# EAGLE design CUTTER (EAGLE 8.6.3)
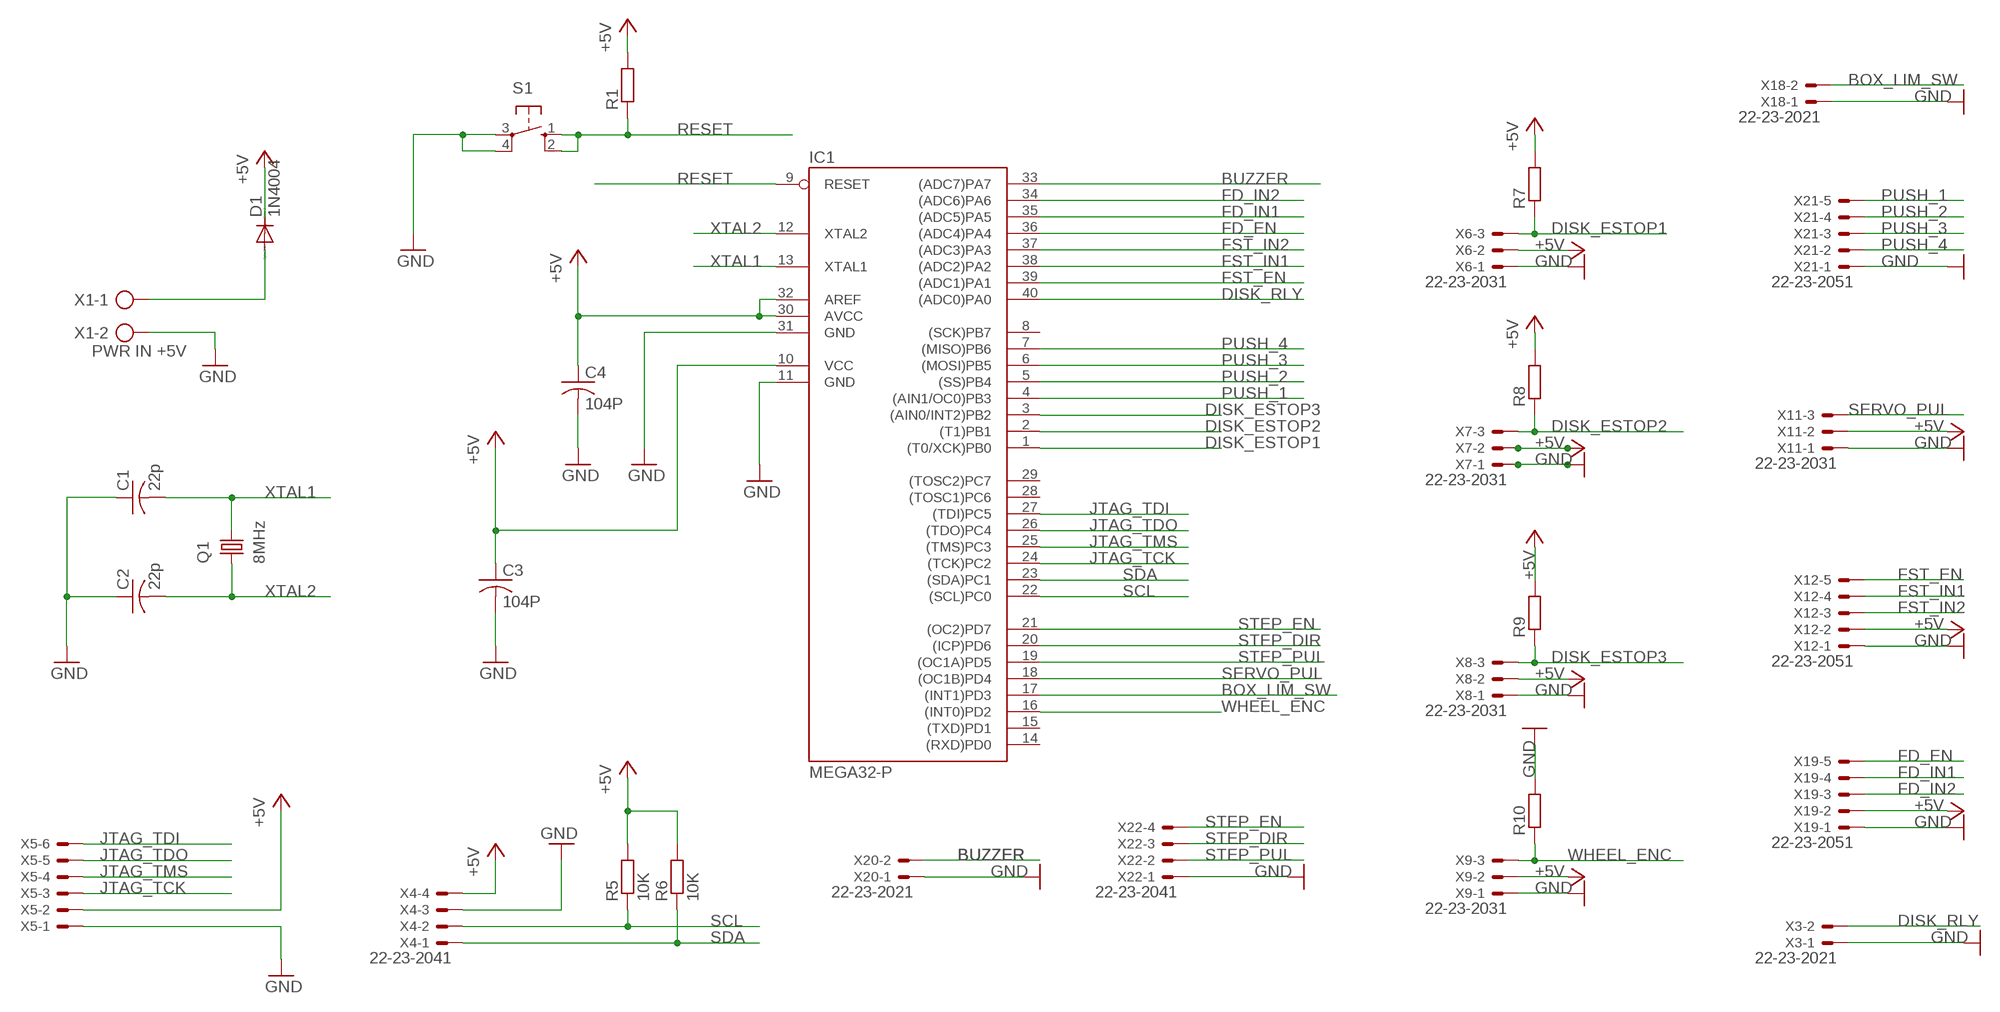
[diagram p0: schematic, sheet 1]

## Parts
C1  22p  C-US025-025X050  [C025-025X050]
C2  22p  C-US025-025X050  [C025-025X050]
C3  104P  C-US025-025X050  [C025-025X050]
C4  104P  C-US025-025X050  [C025-025X050]
D1  1N4004  [DO41-10]
IC1  MEGA32-P  [DIL40]
Q1  8MHz  CRYSTALHC49S  [HC49/S]
R1  R-EU_0207/10  [0207/10]
R5  10K  R-EU_0207/10  [0207/10]
R6  10K  R-EU_0207/10  [0207/10]
R7  R-EU_0207/10  [0207/10]
R8  R-EU_0207/10  [0207/10]
R9  R-EU_0207/10  [0207/10]
R10  R-EU_0207/10  [0207/10]
S1  10-XX  [B3F-10XX]
X1  PWR IN +5V  AK500/2  [AK500/2]
X3  22-23-2021  [22-23-2021]
X4  22-23-2041  [22-23-2041]
X5  22-23-2061  [22-23-2061]
X6  22-23-2031  [22-23-2031]
X7  22-23-2031  [22-23-2031]
X8  22-23-2031  [22-23-2031]
X9  22-23-2031  [22-23-2031]
X11  22-23-2031  [22-23-2031]
X12  22-23-2051  [22-23-2051]
X18  22-23-2021  [22-23-2021]
X19  22-23-2051  [22-23-2051]
X20  22-23-2021  [22-23-2021]
X21  22-23-2051  [22-23-2051]
X22  22-23-2041  [22-23-2041]

## Nets
+5V: C3.1 C4.1 D1.C IC1.10(VCC) IC1.30(AVCC) IC1.32(AREF) R1.2 R5.2 R6.2 R7.2 R8.2 R9.2 X4.4 X5.2 X6.2 X7.2 X8.2 X9.2 X11.2 X12.2 X19.2
BOX_LIM_SW: IC1.17((INT1)PD3) X18.2
BUZZER: IC1.33((ADC7)PA7) X20.2
DISK_ESTOP1: IC1.1((T0/XCK)PB0) R7.1 X6.3
DISK_ESTOP2: IC1.2((T1)PB1) R8.1 X7.3
DISK_ESTOP3: IC1.3((AIN0/INT2)PB2) R9.1 X8.3
DISK_RLY: IC1.40((ADC0)PA0) X3.2
FD_EN: IC1.36((ADC4)PA4) X19.5
FD_IN1: IC1.35((ADC5)PA5) X19.4
FD_IN2: IC1.34((ADC6)PA6) X19.3
FST_EN: IC1.39((ADC1)PA1) X12.5
FST_IN1: IC1.38((ADC2)PA2) X12.4
FST_IN2: IC1.37((ADC3)PA3) X12.3
GND: C1.1 C2.1 C3.2 C4.2 IC1.11(GND) IC1.31(GND) R10.2 S1.3(P) S1.4(P1) X1.2 X3.1 X4.3 X5.1 X6.1 X7.1 X8.1 X9.1 X11.1 X12.1 X18.1 X19.1 X20.1 X21.1 X22.1
JTAG_TCK: IC1.24((TCK)PC2) X5.3
JTAG_TDI: IC1.27((TDI)PC5) X5.6
JTAG_TDO: IC1.26((TDO)PC4) X5.5
JTAG_TMS: IC1.25((TMS)PC3) X5.4
N$1: D1.A X1.1
PUSH_1: IC1.4((AIN1/OC0)PB3) X21.5
PUSH_2: IC1.5((SS)PB4) X21.4
PUSH_3: IC1.6((MOSI)PB5) X21.3
PUSH_4: IC1.7((MISO)PB6) X21.2
RESET: IC1.9(RESET) R1.1 S1.1(S) S1.2(S1)
SCL: IC1.22((SCL)PC0) R5.1 X4.2
SDA: IC1.23((SDA)PC1) R6.1 X4.1
SERVO_PUL: IC1.18((OC1B)PD4) X11.3
STEP_DIR: IC1.20((ICP)PD6) X22.3
STEP_EN: IC1.21((OC2)PD7) X22.4
STEP_PUL: IC1.19((OC1A)PD5) X22.2
WHEEL_ENC: IC1.16((INT0)PD2) R10.1 X9.3
XTAL1: C1.2 IC1.13(XTAL1) Q1.2
XTAL2: C2.2 IC1.12(XTAL2) Q1.1
Unconnected: IC1.8((SCK)PB7) IC1.14((RXD)PD0) IC1.15((TXD)PD1) IC1.28((TOSC1)PC6) IC1.29((TOSC2)PC7)

## Library data of the parts
C1-C4 = rcl:C-US: CAPACITOR, American symbol; SPICEPREFIX: C
D1 = diode:1N4004: DIODE general purpose rectifier, 1 A
IC1 = atmel:MEGA32-P: MICROCONTROLLER 32 Kbytes FLASH 2 Kbytes SRAM 1 Kbytes EEPROM USART 8-channel 10 bit ADC Source: www.atmel.com .. doc2503.pdf; MPN: ATMEGA32-16PU; OC_FARNELL: 1661729; OC_NEWARK: 51P1794
Q1 = crystal:CRYSTAL: CRYSTAL; OC_FARNELL: 1667008; OC_NEWARK: unknown
R1 R5-R10 = rcl:R-EU_: RESISTOR, European symbol; SPICEPREFIX: R
S1 = switch-omron:10-XX: OMRON SWITCH; MPN: B3F-1000; OC_FARNELL: 176432; OC_NEWARK: 36M3542
X1 = con-ptr500:AK500/2: CONNECTOR; OC_FARNELL: unknown; OC_NEWARK: unknown; SPICEPREFIX: X
X3 X18 X20 = con-molex:22-23-2021: .100" (2.54mm) Center Header - 2 Pin; MF: MOLEX; MPN: 22-23-2021; OC_FARNELL: 1462926; OC_NEWARK: 25C3832
X4 X22 = con-molex:22-23-2041: .100" (2.54mm) Center Header - 4 Pin; MF: MOLEX; MPN: 22-23-2041; OC_FARNELL: 1462920; OC_NEWARK: 38C0355
X5 = con-molex:22-23-2061: .100" (2.54mm) Center Header - 6 Pin; MF: MOLEX; MPN: 22-23-2061; OC_FARNELL: 1462922; OC_NEWARK: 27C1933
X6-X9 X11 = con-molex:22-23-2031: .100" (2.54mm) Center Header - 3 Pin; MF: MOLEX; MPN: 22-23-2031; OC_FARNELL: 1462950; OC_NEWARK: 30C0862
X12 X19 X21 = con-molex:22-23-2051: .100" (2.54mm) Center Header - 5 Pin; MF: MOLEX; MPN: 22-23-2051; OC_FARNELL: 1462952; OC_NEWARK: 38C9178

## Board
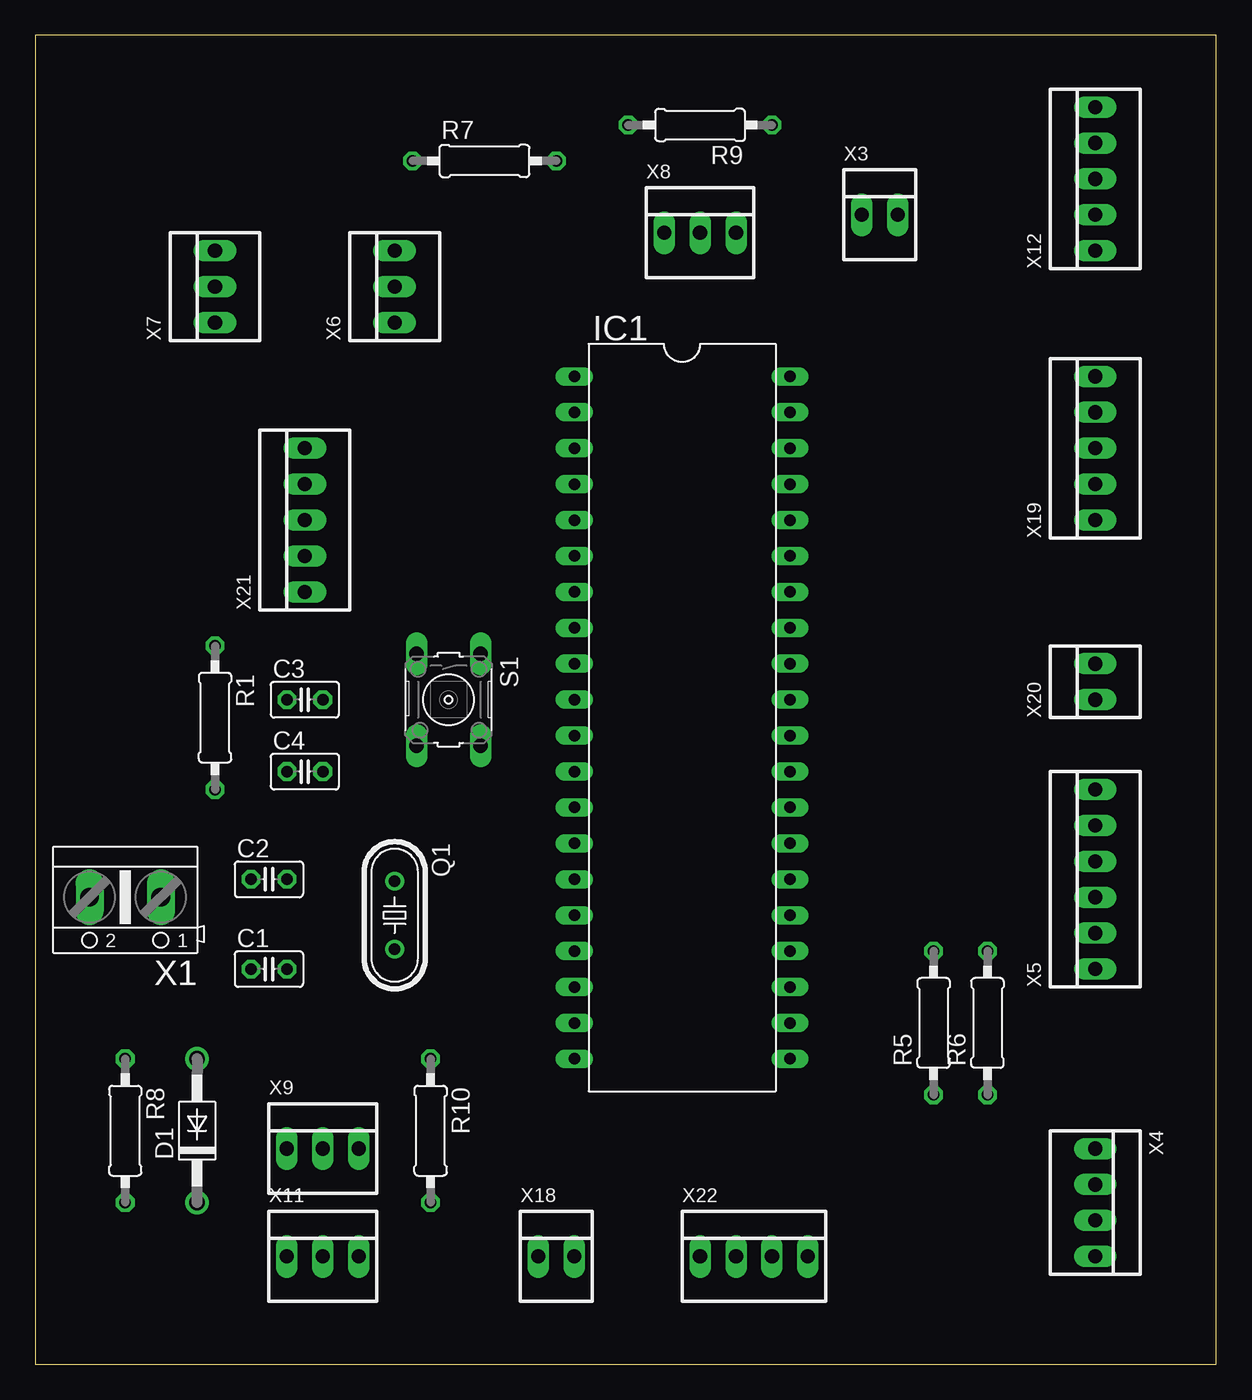
[diagram p1: board, top side]
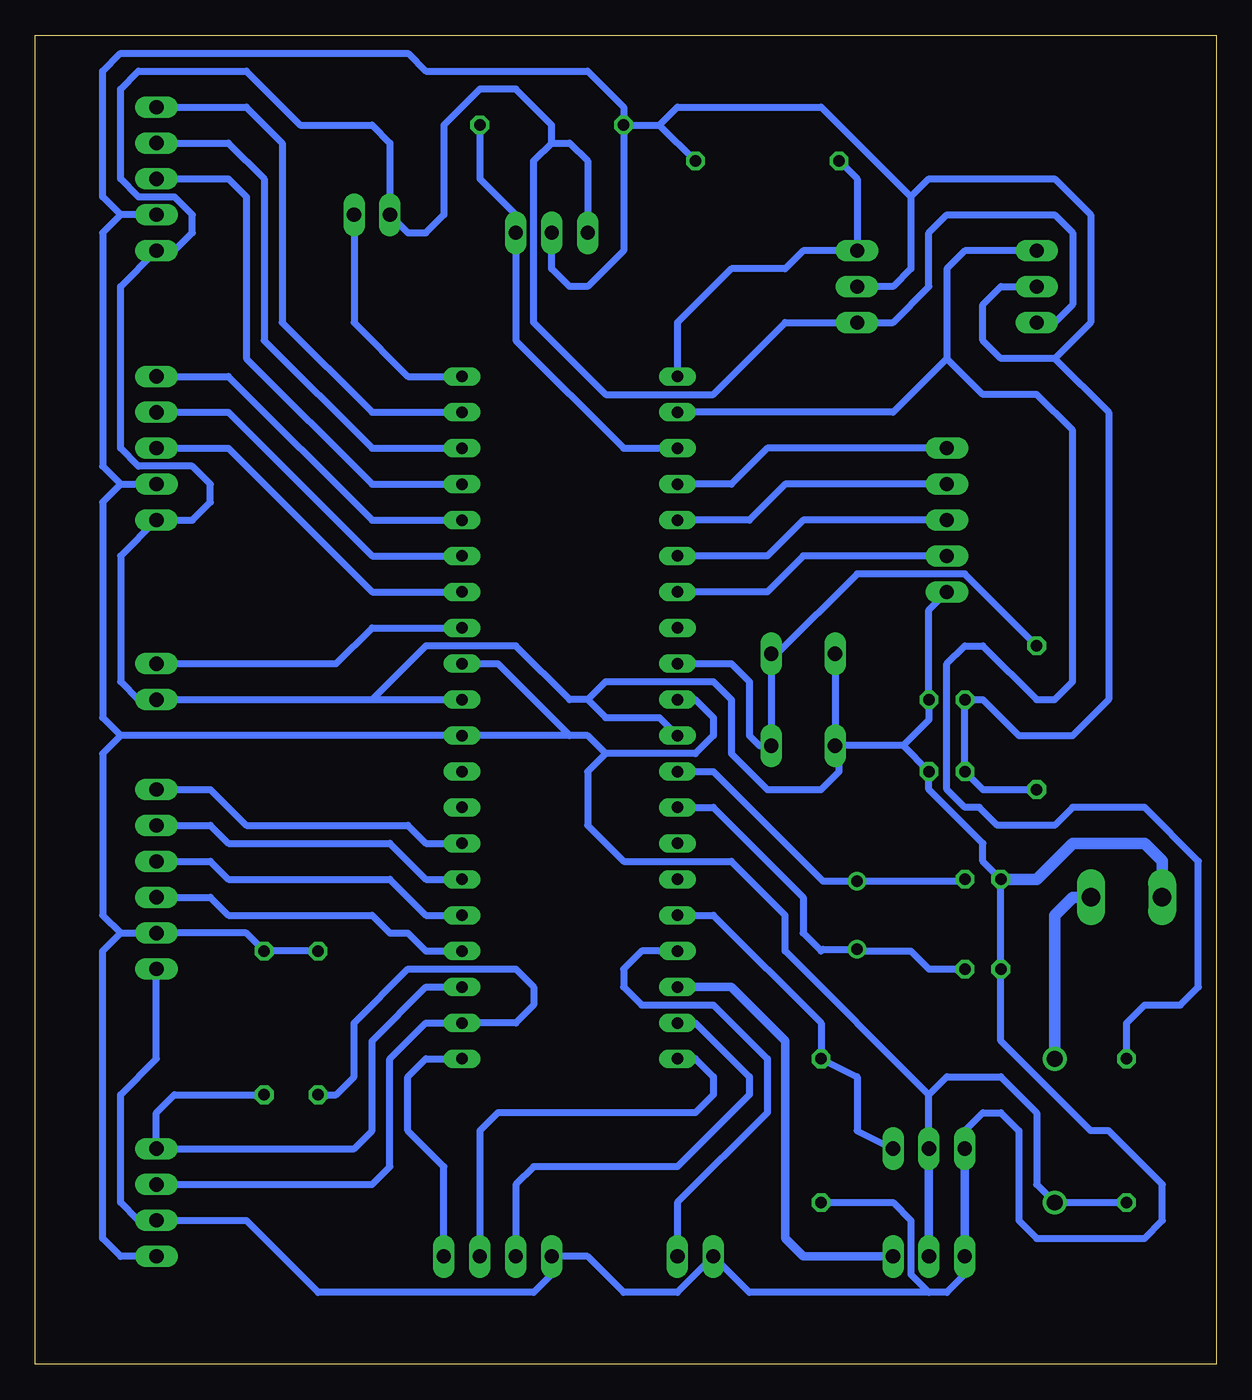
[diagram p2: board, bottom side, seen from below]

Size 83.49 x 93.97 mm. Coordinates in mm from the lower left corner, seen from the top.
Outline: 0,0 83.49,0 83.49,93.97 0,93.97 0,0
Copper layers (1*16): Top 0.035mm / dielectric 1.5mm / Bottom 0.035mm
Design rules "default": minimum track width 6mil, minimum drill 0.35mm, track to track 6mil, track to pad 6mil, pad to pad 6mil, via to via 6mil, smd to smd 6mil, copper to edge 40mil, drill to drill 6mil, minimum pad ring 10mil, minimum via ring 8mil, stop-mask expansion 4mil, vias tented up to drill 0mil, thermal gap 10mil

### Footprints (pad centres in the part's own frame; a part is rotated, then mirrored left to right if it is on the bottom)
C025-025X050 = drill 0.813 octagon: 1 -1.27,0; 2 1.27,0
DO41-10 = drill 1.118: A 5.08,0; C -5.08,0
DIL40 = drill 0.813 long: 1 -24.13,-7.62; 2 -21.59,-7.62; 3 -19.05,-7.62; 4 -16.51,-7.62; 5 -13.97,-7.62; 6 -11.43,-7.62; 7 -8.89,-7.62; 8 -6.35,-7.62; 9 -3.81,-7.62; 10 -1.27,-7.62; 11 1.27,-7.62; 12 3.81,-7.62; 13 6.35,-7.62; 14 8.89,-7.62; 15 11.43,-7.62; 16 13.97,-7.62; 17 16.51,-7.62; 18 19.05,-7.62; 19 21.59,-7.62; 20 24.13,-7.62; 21 24.13,7.62; 22 21.59,7.62; 23 19.05,7.62; 24 16.51,7.62; 25 13.97,7.62; 26 11.43,7.62; 27 8.89,7.62; 28 6.35,7.62; 29 3.81,7.62; 30 1.27,7.62; 31 -1.27,7.62; 32 -3.81,7.62; 33 -6.35,7.62; 34 -8.89,7.62; 35 -11.43,7.62; 36 -13.97,7.62; 37 -16.51,7.62; 38 -19.05,7.62; 39 -21.59,7.62; 40 -24.13,7.62
HC49/S = drill 0.813: 1 -2.413,0; 2 2.413,0
0207/10 = drill 0.813 octagon: 1 -5.08,0; 2 5.08,0
B3F-10XX = drill 1.016 long: 1 -3.251,2.261; 2 3.251,2.261; 3 -3.251,-2.261; 4 3.251,-2.261
AK500/2 = drill 1.321 long: 1 -2.515,0; 2 2.515,0
22-23-2021 = drill 1 long: 1 -1.27,0; 2 1.27,0
22-23-2041 = drill 1 long: 1 -3.81,0; 2 -1.27,0; 3 1.27,0; 4 3.81,0
22-23-2061 = drill 1 long: 1 -6.35,0; 2 -3.81,0; 3 -1.27,0; 4 1.27,0; 5 3.81,0; 6 6.35,0
22-23-2031 = drill 1 long: 1 -2.54,0; 2 0,0; 3 2.54,0
22-23-2051 = drill 1 long: 1 -5.08,0; 2 -2.54,0; 3 0,0; 4 2.54,0; 5 5.08,0

### Placement (x,y rotation side)
C1  16.51,27.94 0 top
C2  16.51,34.29 0 top
C3  19.05,46.99 0 top
C4  19.05,41.91 0 top
D1  11.43,16.51 90 top
IC1  45.72,45.72 270 top
Q1  25.4,31.75 270 top
R1  12.7,45.72 270 top
R5  63.5,24.13 90 top
R6  67.31,24.13 90 top
R7  31.75,85.09 0 top
R8  6.35,16.51 270 top
R9  46.99,87.63 180 top
R10  27.94,16.51 270 top
S1  29.21,46.99 270 top
X1  6.35,33.02 180 top
X3  59.69,81.28 0 top
X4  74.93,11.43 270 top
X5  74.93,34.29 90 top
X6  25.4,76.2 90 top
X7  12.7,76.2 90 top
X8  46.99,80.01 0 top
X9  20.32,15.24 0 top
X11  20.32,7.62 0 top
X12  74.93,83.82 90 top
X18  36.83,7.62 0 top
X19  74.93,64.77 90 top
X20  74.93,48.26 90 top
X21  19.05,59.69 90 top
X22  50.8,7.62 0 top

### Tracks (layer width: path | path; a pad name or v marks a point on that pad's centre or on a via)
+5V
  Bottom 0.508: R5.2 R6.2 68.58,30.48 X5.2 77.47,30.48 | R8.2 D1.C 12.7,12.7 12.7,17.78 15.24,20.32 19.05,20.32 20.32,19.05 | R1.2 16.51,40.64 C4.1 C3.1 16.51,46.99 13.97,44.45 10.16,44.45 7.62,46.99 7.62,67.31 11.43,71.12 | X12.2 77.47,81.28 | 77.47,81.28 78.74,80.01 78.74,63.5 77.47,62.23 | 77.47,62.23 X19.2 | 77.47,81.28 78.74,82.55 78.74,91.44 77.48,92.7 57.14,92.7 55.88,91.44 44.45,91.44 41.91,88.9 R9.2 | R9.2 41.91,78.74 44.45,76.2 45.72,76.2 46.99,77.47 X8.2 | R9.2 39.37,87.63 | 39.37,87.63 R7.2 | 39.37,87.63 38.1,88.9 27.94,88.9 21.59,82.55 | 21.59,82.55 21.59,77.47 22.86,76.2 X6.2 | 21.59,82.55 20.32,83.82 11.43,83.82 8.89,81.28 8.89,73.66 11.43,71.12 | 11.43,76.2 X7.2 15.24,76.2 16.51,74.93 16.51,72.39 15.24,71.12 11.43,71.12 | 77.47,62.23 78.74,60.96 78.74,45.72 77.47,44.45 | 77.47,30.48 78.74,31.75 78.74,43.18 77.47,44.45 | 77.47,44.45 IC1.30 45.72,44.45 | IC1.10 36.83,46.99 35.56,45.72 35.56,44.45 36.83,43.18 43.18,43.18 | 43.18,43.18 44.45,44.45 45.72,44.45 | 43.18,43.18 44.45,41.91 44.45,38.1 41.91,35.56 34.29,35.56 30.48,31.75 30.48,29.21 20.32,19.05 | X9.2 20.32,19.05 | X4.4 77.47,7.62 78.74,8.89 78.74,29.21 77.47,30.48 | IC1.32 50.8,49.53 45.72,44.45
  Bottom 0.61: X11.2 X9.2
BOX_LIM_SW
  Bottom 0.508: 39.37,29.21 IC1.17 40.64,29.21 41.91,27.94 41.91,26.67 40.64,25.4 35.56,25.4 31.75,21.59 31.75,17.78 38.1,11.43 X18.2
BUZZER
  Bottom 0.508: X20.2 62.23,49.53 59.69,52.07 IC1.33
DISK_ESTOP1
  Bottom 0.508: IC1.1 38.1,73.66 34.29,77.47 30.48,77.47 29.21,78.74 X6.3 25.4,83.82 R7.1
DISK_ESTOP2
  Bottom 0.508: X7.3 17.78,78.74 19.05,77.47 19.05,71.12 | 19.05,71.12 22.86,67.31 IC1.2 | 19.05,71.12 16.51,68.58 12.7,68.58 10.16,66.04 10.16,48.26 11.43,46.99 12.7,46.99 16.51,50.8 17.78,50.8 19.05,49.53 19.05,40.64 17.78,39.37 16.75,39.37 15.48,38.1 11.43,38.1 10.16,39.37 5.08,39.37 1.27,35.56 1.27,26.67 2.54,25.4 5.08,25.4 6.35,24.13 R8.1
DISK_ESTOP3
  Bottom 0.508: IC1.3 41.91,64.77 49.53,72.39 X8.3 49.53,81.28 52.07,83.82 R9.1
DISK_RLY
  Bottom 0.508: X3.2 60.96,73.66 57.15,69.85 IC1.40
FD_EN
  Bottom 0.508: X19.5 69.85,69.85 59.69,59.69 IC1.36
FD_IN1
  Bottom 0.508: X19.4 69.85,67.31 59.69,57.15 IC1.35
FD_IN2
  Bottom 0.508: X19.3 69.85,64.77 59.69,54.61 IC1.34
FST_EN
  Bottom 0.508: X12.5 68.58,88.9 66.04,86.36 66.04,73.66 59.69,67.31 IC1.39
FST_IN1
  Bottom 0.508: X12.4 69.85,86.36 67.31,83.82 67.31,72.39 59.69,64.77 IC1.38
FST_IN2
  Bottom 0.508: X12.3 69.85,83.82 68.58,82.55 68.58,71.12 59.69,62.23 IC1.37
GND
  Bottom 0.508: X11.1 17.78,6.35 19.05,5.08 20.32,5.08 | 20.32,5.08 33.02,5.08 X18.1 38.1,5.08 41.91,5.08 44.45,7.62 X22.1 46.99,6.35 48.26,5.08 63.5,5.08 68.58,10.16 X4.3 76.2,10.16 77.47,11.43 77.47,19.05 74.93,21.59 X5.1 | 59.69,46.99 X20.1 76.2,46.99 77.47,48.26 77.47,57.15 X19.1 72.39,59.69 71.12,60.96 71.12,62.23 72.39,63.5 76.2,63.5 77.47,64.77 77.47,76.2 X12.1 73.66,78.74 72.39,80.01 72.39,81.28 73.66,82.55 76.2,82.55 77.47,83.82 77.47,90.17 76.2,91.44 68.58,91.44 64.77,87.63 59.69,87.63 58.42,86.36 X3.1 57.15,80.01 55.88,80.01 54.61,81.28 54.61,87.63 52.07,90.17 49.53,90.17 46.99,87.63 46.99,86.36 | 59.69,46.99 IC1.31 | 22.15,43.74 S1.4 | S1.3 S1.4 | X21.1 20.32,53.34 C3.2 20.32,45.57 22.15,43.74 | X9.1 17.78,16.51 16.51,17.78 15.24,17.78 13.97,16.51 13.97,10.16 12.7,8.89 5.08,8.89 3.81,10.16 3.81,12.7 7.62,16.51 8.89,16.51 15.24,22.86 C1.1 C2.1 16.51,35.56 16.51,36.83 20.32,40.64 C4.2 22.15,43.74 | X8.1 44.45,85.09 45.72,86.36 46.99,86.36 | X7.1 11.43,73.66 10.16,74.93 10.16,80.01 11.43,81.28 19.05,81.28 20.32,80.01 20.32,76.2 22.86,73.66 X6.1 30.48,73.66 35.56,68.58 43.18,68.58 48.26,73.66 48.26,85.09 46.99,86.36 | 44.45,46.99 43.18,48.26 35.56,48.26 34.29,46.99 34.29,43.18 31.75,40.64 27.94,40.64 26.67,41.91 26.67,43.46 S1.4 | 44.45,46.99 43.18,45.72 39.37,45.72 IC1.11 | R10.2 22.86,11.43 21.59,10.16 21.59,6.35 20.32,5.08 | 44.45,46.99 45.72,46.99 49.53,50.8 55.88,50.8 59.69,46.99
  Bottom 0.61: X11.1 X9.1
  Bottom 0.813: C2.1 12.7,34.29 10.16,36.83 5.08,36.83 3.84,35.59 X1.2
JTAG_TCK
  Bottom 0.508: X5.3 71.12,33.02 69.85,31.75 59.69,31.75 58.42,30.48 57.15,30.48 55.88,29.21 IC1.24
JTAG_TDI
  Bottom 0.508: X5.6 71.12,40.64 68.58,38.1 57.15,38.1 55.88,36.83 IC1.27
JTAG_TDO
  Bottom 0.508: X5.5 71.12,38.1 69.85,36.83 58.42,36.83 55.88,34.29 IC1.26
JTAG_TMS
  Bottom 0.508: X5.4 71.12,35.56 69.85,34.29 58.42,34.29 55.88,31.75 IC1.25
N$1
  Bottom 0.813: X1.1 10.16,33.02 11.43,31.75 D1.A
PUSH_1
  Bottom 0.508: X21.5 31.75,64.77 34.29,62.23 IC1.4
PUSH_2
  Bottom 0.508: X21.4 30.48,62.23 33.02,59.69 IC1.5
PUSH_3
  Bottom 0.508: X21.3 29.21,59.69 31.75,57.15 IC1.6
PUSH_4
  Bottom 0.508: X21.2 29.21,57.15 31.75,54.61 IC1.7
RESET
  Bottom 0.508: R1.1 17.78,55.88 25.4,55.88 31.04,50.24 S1.1 31.47,44.02 31.75,43.74 S1.2 32.31,43.74 33.02,44.45 33.02,48.26 34.29,49.53 IC1.9
SCL
  Bottom 0.508: X4.2 59.69,12.7 58.42,13.97 58.42,21.59 55.88,24.13 IC1.22 49.53,24.13 48.26,25.4 48.26,26.67 49.53,27.94 57.15,27.94 60.96,24.13 60.96,20.32 62.23,19.05 R5.1
SDA
  Bottom 0.508: R6.1 73.66,19.05 74.93,17.78 X4.1 60.96,15.24 59.69,16.51 59.69,22.86 55.88,26.67 IC1.23
SERVO_PUL
  Bottom 0.61: X11.3 29.21,7.62 30.48,8.89 30.48,22.86 34.29,26.67 IC1.18
STEP_DIR
  Bottom 0.508: IC1.20 36.83,21.59 35.56,20.32 35.56,19.05 36.83,17.78 50.8,17.78 52.07,16.51 X22.3
STEP_EN
  Bottom 0.508: X22.4 54.61,13.97 57.15,16.51 57.15,20.32 55.88,21.59 IC1.21
STEP_PUL
  Bottom 0.508: X22.2 49.53,12.7 48.26,13.97 38.1,13.97 33.02,19.05 33.02,20.32 36.83,24.13 IC1.19
WHEEL_ENC
  Bottom 0.508: X9.3 25.4,16.51 25.4,20.32 R10.1 27.94,24.13 35.56,31.75 IC1.16
XTAL1
  Bottom 0.508: IC1.13 35.56,39.37 29.21,33.02 29.21,30.48 27.94,29.21 27.81,29.34 Q1.2 25.27,29.21 21.59,29.21 20.32,27.94 C1.2
XTAL2
  Bottom 0.508: IC1.12 35.56,41.91 27.81,34.16 Q1.1 17.91,34.16 C2.2